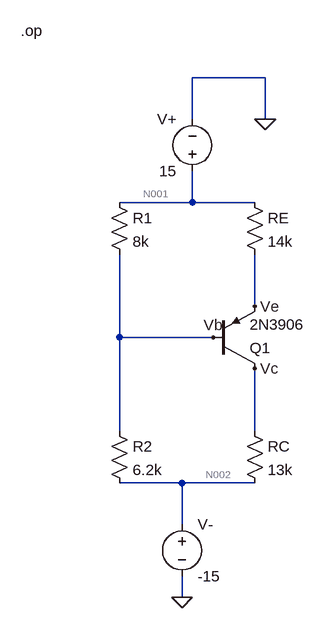
[diagram p0: schematic part2.asc]
part2.asc, the LTspice schematic file:
Version 4.1
SHEET 1 880 680
WIRE 336 -224 224 -224
WIRE 224 -160 224 -224
WIRE 336 -160 336 -224
WIRE 224 -32 224 -80
WIRE 224 -32 112 -32
WIRE 320 -32 224 -32
WIRE 320 128 320 48
WIRE 112 176 112 48
WIRE 256 176 112 176
WIRE 112 320 112 176
WIRE 320 320 320 224
WIRE 208 400 112 400
WIRE 320 400 208 400
WIRE 208 464 208 400
WIRE 208 576 208 544
FLAG 208 576 0
FLAG 336 -160 0
FLAG 320 128 Ve
FLAG 256 176 Vb
FLAG 320 224 Vc
SYMBOL res 304 -48 R0
SYMATTR InstName RE
SYMATTR Value 14k
SYMBOL res 304 304 R0
SYMATTR InstName RC
SYMATTR Value 13k
SYMBOL res 96 -48 R0
SYMATTR InstName R1
SYMATTR Value 8k
SYMBOL res 96 304 R0
SYMATTR InstName R2
SYMATTR Value 6.2k
SYMBOL pnp 256 224 M180
SYMATTR InstName Q1
SYMATTR Value 2N3906
SYMBOL voltage 208 448 R0
SYMATTR InstName V-
SYMATTR Value -15
SYMBOL voltage 224 -64 R180
WINDOW 0 24 96 Left 2
WINDOW 3 24 16 Left 2
SYMATTR InstName V+
SYMATTR Value 15
TEXT -40 -296 Left 2 !.op

The netlist it stands for:
* part2.asc
RE N001 Ve 14k
RC Vc N002 13k
R1 N001 Vb 8k
R2 Vb N002 6.2k
Q1 Vc Vb Ve 0 2N3906
V- N002 0 -15
V+ N001 0 15
.model NPN NPN
.model PNP PNP
.lib standard.bjt
.op
.backanno
.end

* Results of the author's LTspice run, read from the files saved beside the schematic
* Operating Point:
*   V(ve) = -995.9 mV
*   V(n002) = -15 V
*   V(vb) = -1.661 V
*   V(n001) = 15 V
*   V(vc) = -1.041 V
*   I(RE) = 1.143 mA
*   Ic(Q1) = -1.074 mA
*   Ib(Q1) = -68.79 µA
*   Ie(Q1) = 1.143 mA
*   Is(Q1) = 0 A
*   I(R1) = 2.083 mA
*   I(V-) = 3.225 mA
*   I(R2) = 2.151 mA
*   I(V+) = -3.225 mA
*   I(RC) = 1.074 mA